# Altium schematic sheet SCB_CLKs.SchDoc: SCB_CLKs
size A3 portrait; PageSetup: Record=PageOptions|CenterHorizontal=True|CenterVertical=True|PrintScale=1.00|XCorrection=1.00|YCorrection=1.00|PrintKind=1|BorderSize=5000000|LeftOffset=0|BottomOffset=0|Orientation=1|PaperLength=1000|PaperWidth=1000|Scale=100|PaperSource=7|PrintQuality=-4|MediaType=1|DitherType=10|PaperKind=A4|PrintScaleMode=1; Revision: 3.4; SheetNumber: 3; SheetTotal: 23; Date: 18/06/2014; DrawnBy: J. Gabriel R.E.; Organization: Seven Solutions S.L.; Address1: C/Baza, Parcela 19, Nave 3; Address2: Polнgono Ind. Juncaril; Address3: 18210-Peligros-Granada; Address4: Spain; WebAddress: www.sevensols.com; Project: White Rabbit; ProjectName: White Rabbit
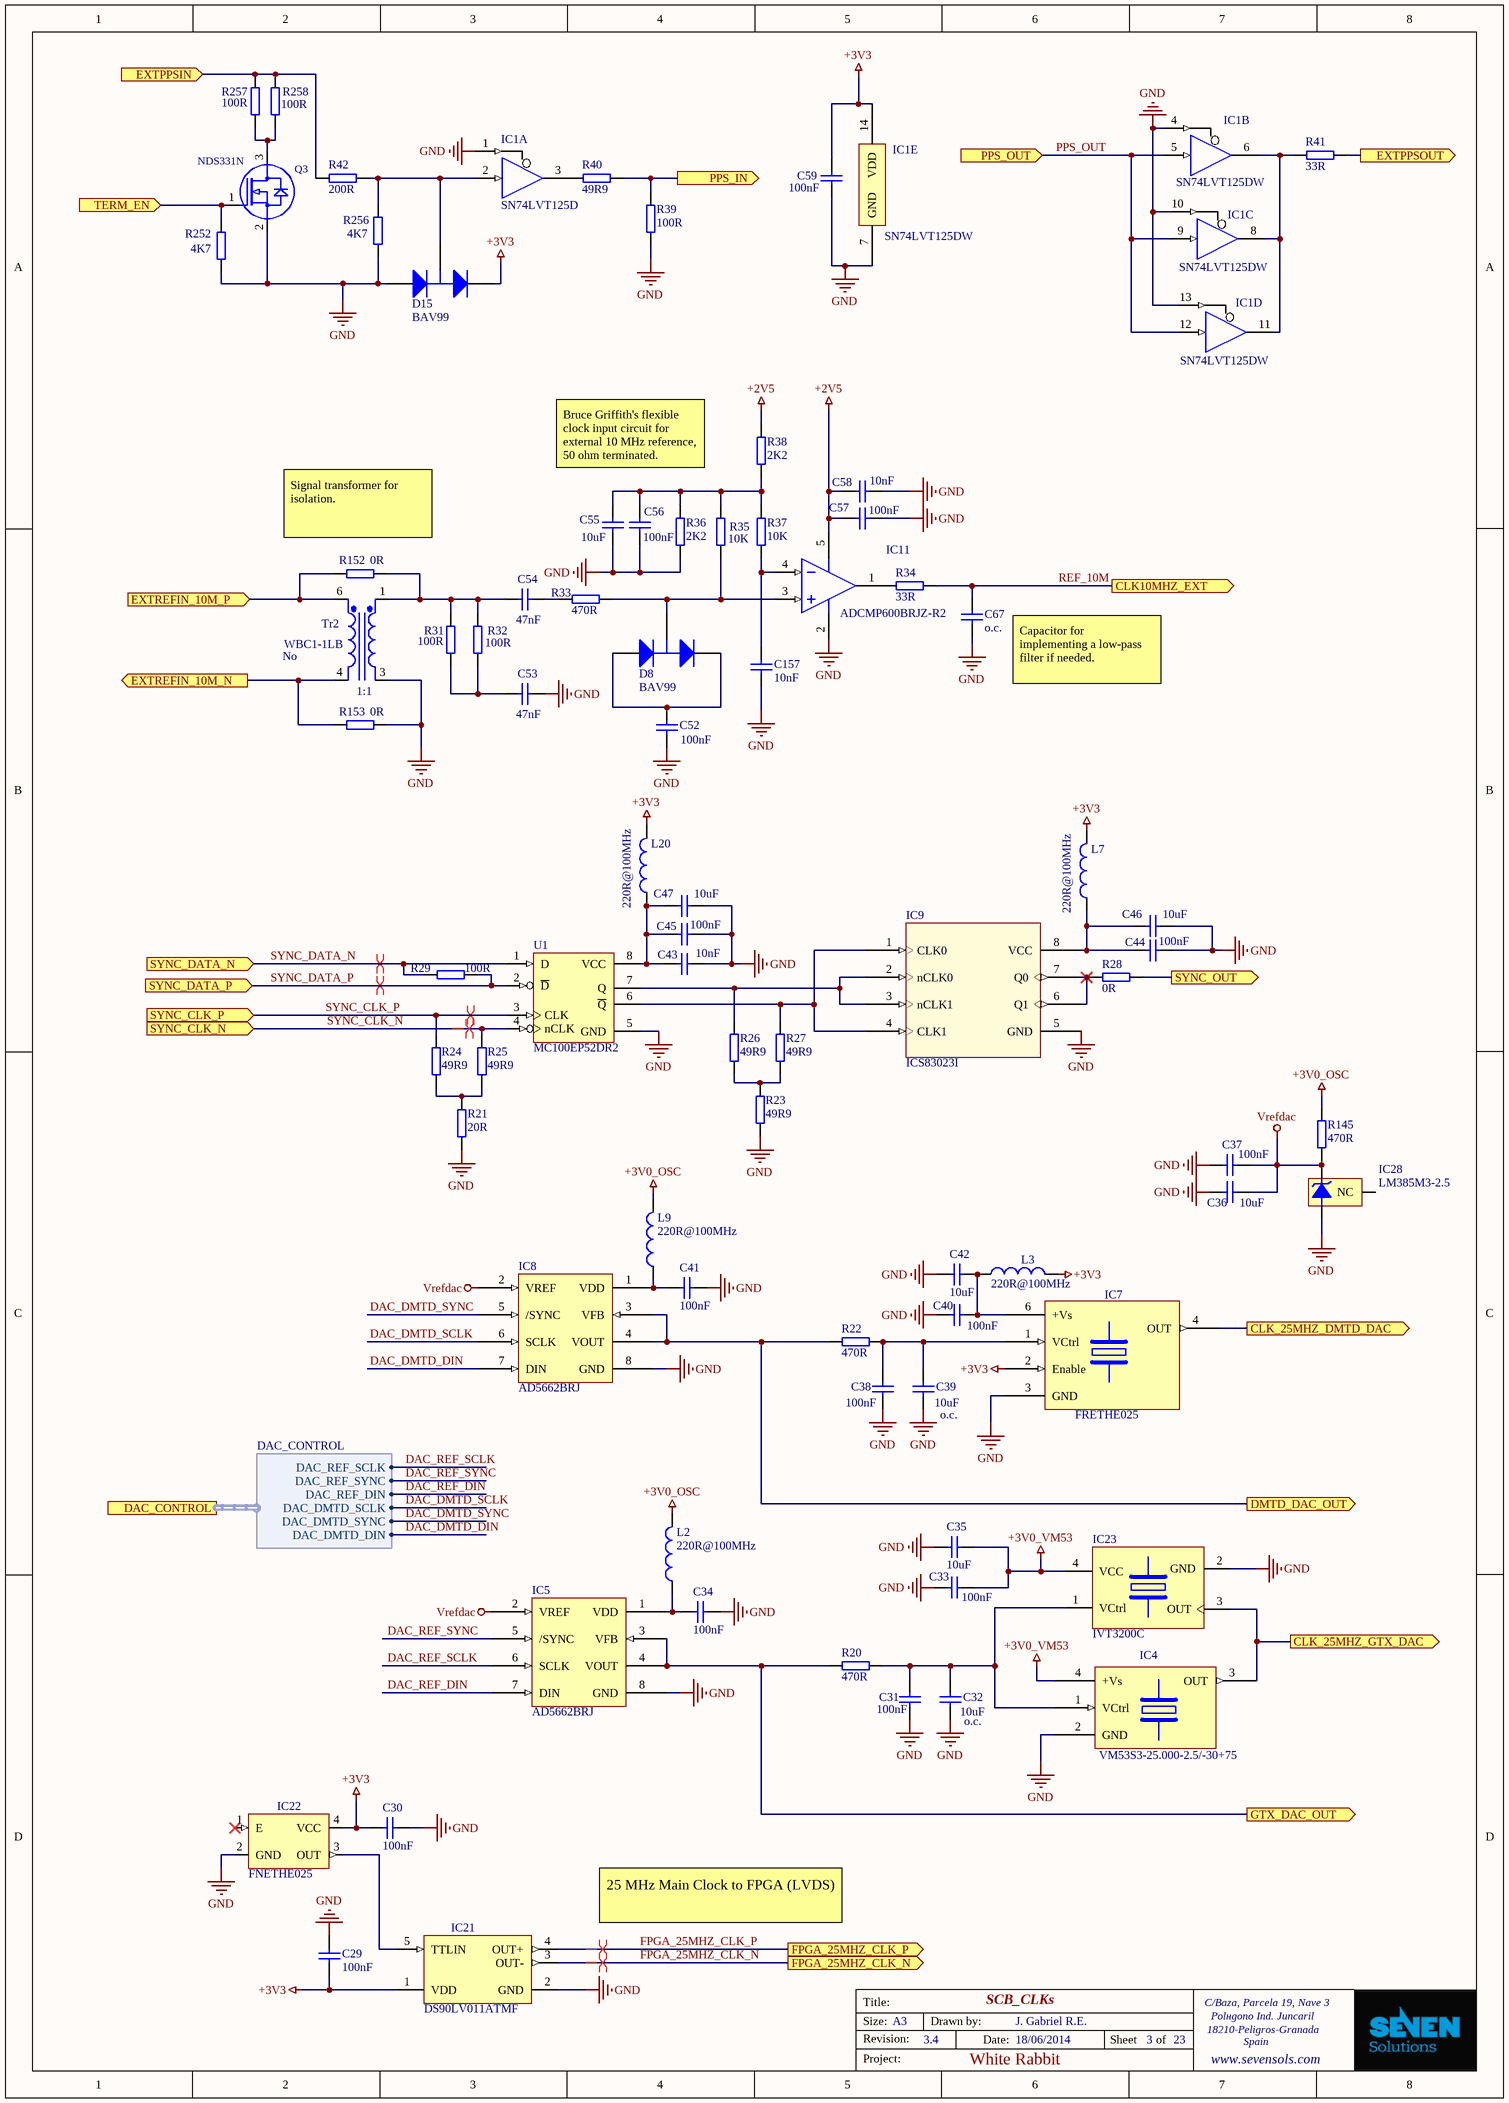
[diagram p0: SCB_CLKs.SchDoc]

## Parts
C29  100nF  [CC1005-0402]
C30  100nF  [CC1005-0402]
C31  100nF  [CC1005-0402]
C32  10uF  value o.c.  [CC1608-0603]
C33  100nF  [CC1005-0402]
C34  100nF  [CC1005-0402]
C35  10uF  [CC1608-0603]
C36  10uF  [CC1608-0603]
C37  100nF  [CC1005-0402]
C38  100nF  [CC1005-0402]
C39  10uF  value o.c.  [CC1608-0603]
C40  100nF  [CC1005-0402]
C41  100nF  [CC1005-0402]
C42  10uF  [CC1608-0603]
C43  10nF  [CC1005-0402]
C44  100nF  [CC1005-0402]
C45  100nF  [CC1005-0402]
C46  10uF  [CC1608-0603]
C47  10uF  [CC1608-0603]
C52  100nF  [CC1005-0402]
C53  47nF  [CC1005-0402]
C54  47nF  [CC1005-0402]
C55  10uF  [CC1608-0603]
C56  100nF  [CC1005-0402]
C57  100nF  [CC1005-0402]
C58  10nF  [CC1005-0402]
C59  100nF  [CC1005-0402]
C67  o.c.  [CC1608-0603]
C157  10nF  [CC1005-0402]
D8  BAV99  [SOT-23]
D15  BAV99  [SOT-23]
IC1  SN74LVT125D  [SO-14]  (parts A,B,C,D,E of 5)
IC4  VM53S3-25.000-2.5/-30+75  [VCTCXO_VM53S]
IC5  value AD5662BRJ  [SOT23-8]  (hidden comment: AD5662B)
IC7  FRETHE025  [vs-705]
IC8  value AD5662BRJ  [SOT23-8]  (hidden comment: AD5662B)
IC9  ICS83023I  [SOIC127P600X175-8N]
IC11  ADCMP600BRJZ-R2  [SOT23-5AL]
IC21  DS90LV011ATMF  [MF05A_N]
IC22  FNETHE025  [SPXO]
IC23  IVT3200C  [OSC_RAKON_IVT3200C]
IC28  LM385M3-2.5  [MF03A_N]
L2  Impedance: 220R@100MHz  [0603]  (hidden comment: 220R@100MHz Ferrite Bead)
L3  Impedance: 220R@100MHz  [0603]  (hidden comment: 220R@100MHz Ferrite Bead)
L7  Impedance: 220R@100MHz  [0603]  (hidden comment: 220R@100MHz Ferrite Bead)
L9  Impedance: 220R@100MHz  [0603]  (hidden comment: 220R@100MHz Ferrite Bead)
L20  Impedance: 220R@100MHz  [0603]  (hidden comment: 220R@100MHz Ferrite Bead)
Q3  NDS331N  [SOT23-3]
R20  470R  [0402]
R21  20R  [0603]
R22  470R  [0402]
R23  49R9  [0402]
R24  49R9  [0402]
R25  49R9  [0402]
R26  49R9  [0402]
R27  49R9  [0402]
R28  value 0R  [0402]  (hidden comment: Jumper)
R29  100R  [0402]
R31  100R  [0805]
R32  100R  [0805]
R33  470R  [0402]
R34  33R  [0603]
R35  10k  [0402]
R36  2K2  [0402]
R37  10k  [0402]
R38  2K2  [0402]
R39  100R  [0402]
R40  49R9  [0603]
R41  33R  [0603]
R42  200R  [0402]
R145  470R  [0402]
R152  value 0R  [0402]  (hidden comment: Jumper)
R153  value 0R  [0402]  (hidden comment: Jumper)
R252  4K7  [0402]
R256  4K7  [0402]
R257  100R  [0805]
R258  100R  [0805]
Tr2  WBC1-1LB  value 1:1  Mounted: No  [SMT6P150P]
U1  MC100EP52DR2  [TSOP65P490-8AN]

## Ports
CLK10MHZ_EXT (out), CLK_25MHZ_DMTD_DAC (out), CLK_25MHZ_GTX_DAC (out), DAC_CONTROL (harness DAC_CONTROL), DMTD_DAC_OUT (out), EXTPPSIN (in), EXTPPSOUT (out), EXTREFIN_10M_N (out), EXTREFIN_10M_P (in), FPGA_25MHZ_CLK_N (out), FPGA_25MHZ_CLK_P (out), GTX_DAC_OUT (out), PPS_IN (out), PPS_OUT (in), SYNC_CLK_N (in), SYNC_CLK_P (in), SYNC_DATA_N (in), SYNC_DATA_P (in), SYNC_OUT (out), TERM_EN (in)

## Harnesses
DAC_CONTROL: DAC_DMTD_DIN, DAC_DMTD_SYNC, DAC_DMTD_SCLK, DAC_REF_DIN, DAC_REF_SYNC, DAC_REF_SCLK

## Nets
+2V5: C57.2 C58.2 IC11.5(VCC/VCCO) R38.2
+3V0_OSC: L2.2 L9.2 R145.2
+3V0_VM53: C33.1 C35.1 IC4.4(+Vs) IC23.4(VCC)
+3V3: C29.2 C30.2 C59.2 D15.2(K) IC1.14(VDD) IC7.2(Enable) IC21.1(VDD) IC22.4(VCC) L3.2 L7.2 L20.2
GND: C29.1 C30.1 C31.1 C32.1 C33.2 C34.1 C35.2 C36.1 C37.2 C38.1 C39.1 C40.2 C41.1 C42.2 C43.2 C44.1 C45.1 C46.1 C47.1 C52.1 C53.2 C55.1 C56.1 C57.1 C58.1 C59.1 C67.1 C157.2 D15.1(A) IC1.1(~{A}) IC1.4(~{A}) IC1.7(GND) IC1.10(~{A}) IC1.13(~{A}) IC4.2(GND) IC5.8(GND) IC7.3(GND) IC8.8(GND) IC9.5(GND) IC11.2(VEE) IC21.2(GND) IC22.2(GND) IC23.2(GND) IC28.2(-V) Q3.2(SOURCE) R21.1 R23.2 R36.1 R39.1 R153.1 R252.2 R256.2 Tr2.3(Sec-) U1.5(GND)
Vrefdac: C36.2 C37.1 IC5.2(VREF) IC8.2(VREF) IC28.1(+V) R145.1
CLK_25MHZ_DMTD_DAC: IC7.4(OUT) ; port CLK_25MHZ_DMTD_DAC
CLK_25MHZ_GTX_DAC: IC4.3(OUT) IC23.3(OUT) ; port CLK_25MHZ_GTX_DAC
DAC_DMTD_DIN: IC8.7(DIN) ; port DAC_CONTROL.DAC_DMTD_DIN
DAC_DMTD_SCLK: IC8.6(SCLK) ; port DAC_CONTROL.DAC_DMTD_SCLK
DAC_DMTD_SYNC: IC8.5(/SYNC) ; port DAC_CONTROL.DAC_DMTD_SYNC
DAC_REF_DIN: IC5.7(DIN) ; port DAC_CONTROL.DAC_REF_DIN
DAC_REF_SCLK: IC5.6(SCLK) ; port DAC_CONTROL.DAC_REF_SCLK
DAC_REF_SYNC: IC5.5(/SYNC) ; port DAC_CONTROL.DAC_REF_SYNC
DMTD_DAC_OUT: IC8.3(VFB) IC8.4(VOUT) R22.1 ; port DMTD_DAC_OUT
EXTPPSIN: R42.2 R257.2 R258.2 ; port EXTPPSIN
EXTPPSOUT: R41.2 ; port EXTPPSOUT
EXTREFIN_10M_N: R153.2 Tr2.4(Pri-) ; port EXTREFIN_10M_N
EXTREFIN_10M_P: R152.2 Tr2.6(Pri+) ; port EXTREFIN_10M_P
FPGA_25MHZ_CLK_N: IC21.3(OUT-) ; port FPGA_25MHZ_CLK_N
FPGA_25MHZ_CLK_P: IC21.4(OUT+) ; port FPGA_25MHZ_CLK_P
GTX_DAC_OUT: IC5.3(VFB) IC5.4(VOUT) R20.1 ; port GTX_DAC_OUT
PPS_IN: R39.2 R40.2 ; port PPS_IN
PPS_OUT: IC1.5(B) IC1.9(B) IC1.12(B) ; port PPS_OUT
REF_10M: C67.2 R34.2 ; port CLK10MHZ_EXT
SYNC_CLK_N: R25.1 U1.4(nCLK) ; port SYNC_CLK_N
SYNC_CLK_P: R24.1 U1.3(CLK) ; port SYNC_CLK_P
SYNC_DATA_N: R29.1 U1.1(D) ; port SYNC_DATA_N
SYNC_DATA_P: R29.2 U1.2(~{D}) ; port SYNC_DATA_P
SYNC_OUT: R28.2 ; port SYNC_OUT
TERM_EN: Q3.1(GATE) R252.1 ; port TERM_EN
NetC31_2: C31.2 C32.2 IC4.1(VCtrl) IC23.1(VCtrl) R20.2
NetC34_2: C34.2 IC5.1(VDD) L2.1
NetC38_2: C38.2 C39.2 IC7.1(VCtrl) R22.2
NetC40_1: C40.1 C42.1 IC7.6(+Vs) L3.1
NetC41_2: C41.2 IC8.1(VDD) L9.1
NetC43_1: C43.1 C45.2 C47.2 L20.1 U1.8(VCC)
NetC44_2: C44.2 C46.2 IC9.8(VCC) L7.1
NetC52_2: C52.2 D8.1(A) D8.2(K)
NetC53_1: C53.1 R31.1 R32.1
NetC54_1: C54.1 R31.2 R32.2 R152.1 Tr2.1(Sec+)
NetC54_2: C54.2 R33.1
NetC55_2: C55.2 C56.2 R35.2 R36.2 R37.2 R38.1
NetC157_1: C157.1 IC11.4(VN) R37.1
NetD8_3: D8.3(C) IC11.3(VP) R33.2 R35.1
NetD15_3: D15.3(C) IC1.2(B) R42.1 R256.1
NetIC1_3: IC1.3(Y) R40.1
NetIC1_6: IC1.6(Y) IC1.8(Y) IC1.11(Y) R41.1
NetIC9_1: IC9.1(CLK0) IC9.4(CLK1) R27.1 U1.6(~{Q})
NetIC9_2: IC9.2(nCLK0) IC9.3(nCLK1) R26.1 U1.7(Q)
NetIC9_6: IC9.6(Q1) IC9.7(Q0) R28.1
NetIC11_1: IC11.1(Q) R34.1
NetIC21_5: IC21.5(TTLIN) IC22.3(OUT)
NetQ3_3: Q3.3(DRAIN) R257.1 R258.1
NetR21_2: R21.2 R24.2 R25.2
NetR23_1: R23.1 R26.2 R27.2

Not connected (* = marked no-connect by the designer): IC22 1(E)*; IC28 3(NC)

## Layout directives
differential pair: FPGA_25MHZ_CLK_N, FPGA_25MHZ_CLK_P, SYNC_CLK_N, SYNC_CLK_P, SYNC_DATA_N, SYNC_DATA_P

## Notes on the sheet
- Bruce Griffith's flexible clock input circuit for external 10 MHz reference, 50 ohm terminated.
- (near R152) Signal transformer for isolation.
- (near C67) Capacitor for implementing a low-pass filter if needed.
- 25 MHz Main Clock to FPGA (LVDS)
- Title:
- Size:
- Revision:
- A3
- Drawn by:
- Date:
- Sheet
- of
- Project:

## Library data of the parts
C29-C31 C33 C34 C37 C38 C40 C41 C44 C45 C52 C56 C57 C59 = CC0402_100NF_16V_10%_X7R: Capacitor; Manufacturer1: TDK; Manufacturer1 PN: C1005X7R1C104K; TC: X7R; Tolerance: ±10%; Voltage: 16V; Published: 8-Jun-2000; LatestRevisionDate: 17-Jul-2002; LatestRevisionNote: Re-released for DXP Platform.; PackageReference: RAD-0.3; Publisher: Altium Limited; Distributor1: Digikey; Distributor1 PN: 445-4952-1-ND; Case: 0402; Value: 100nF
C32 C39 = CC0603_10UF_6.3V_20%_X5R: Capacitor; Manufacturer1: TDK; Manufacturer1 PN: C1608X5R0J106M; TC: X5R; Tolerance: ±20%; Voltage: 6.3V; Mounted: No; Published: 8-Jun-2000; LatestRevisionDate: 17-Jul-2002; LatestRevisionNote: Re-released for DXP Platform.; PackageReference: RAD-0.3; Publisher: Altium Limited; Distributor1: Digikey; Distributor1 PN: 445-4112-1-ND; Case: 0603
C35 C36 C42 C46 C47 C55 = CC0603_10UF_6.3V_20%_X5R: Capacitor; Manufacturer1: TDK; Manufacturer1 PN: C1608X5R0J106M; TC: X5R; Tolerance: ±20%; Voltage: 6.3V; Published: 8-Jun-2000; LatestRevisionDate: 17-Jul-2002; LatestRevisionNote: Re-released for DXP Platform.; PackageReference: RAD-0.3; Publisher: Altium Limited; Distributor1: Digikey; Distributor1 PN: 445-4112-1-ND; Case: 0603; Value: 10uF
C43 C58 C157 = CC0402_10NF_25V_10%_X7R: Capacitor; Manufacturer1: TDK; Manufacturer1 PN: C1005X7R1E103K; TC: X7R; Tolerance: ±10%; Voltage: 25V; Published: 8-Jun-2000; LatestRevisionDate: 17-Jul-2002; LatestRevisionNote: Re-released for DXP Platform.; PackageReference: RAD-0.3; Publisher: Altium Limited; Distributor1: Digikey; Distributor1 PN: 445-1260-1-ND; Case: 0402; Value: 10nF
C53 C54 = CC0402_47NF_25V_10%_X7R: Capacitor; Manufacturer1: TDK; Manufacturer1 PN: C1005X7R1E473K; TC: X7R; Tolerance: ±10%; Voltage: 25V; Published: 8-Jun-2000; LatestRevisionDate: 17-Jul-2002; LatestRevisionNote: Re-released for DXP Platform.; PackageReference: RAD-0.3; Publisher: Altium Limited; Distributor1: Digikey; Distributor1 PN: 445-4941-1-ND; Case: 0402; Value: 47nF
C67 = CC0603_O.C.: Capacitor; Manufacturer1: Phycomp; TC: X7R; Tolerance: ±10%; Voltage: 16V; Mounted: No; Published: 8-Jun-2000; LatestRevisionDate: 17-Jul-2002; LatestRevisionNote: Re-released for DXP Platform.; PackageReference: RAD-0.3; Publisher: Altium Limited; Manufacturer1 PN: *; Distributor1: Digikey; Distributor1 PN: *; Case: 0402; Value: o.c.
D8 D15 = BAV99: Silicon Switching Diode Array for High-Speed Switching; RefId: 1081211; Published: 21-Mar-2003; DatasheetDocument: Oct-1999; PackageDocument: Sep-2001; PackageReference: SOT-23; Publisher: Altium Limited; ComponentLink1Description: Manufacturer Link; ComponentLink1URL: http://www.infineon.com/; ComponentLink2Description: Datasheet; ComponentLink2URL: http://www.infineon.com/upload/Document/cmc_upload/documents/080/631/bav99series_1.pdf; Supplier: Farnell; Value: BAV99
IC1 = SN74LVT125: Quad Buffer with 3-State Outputs with TTL Compatible Inputs; Value: SN74LVT125D; Distributor1 PN: 9592849; Distributor1: Farnell
IC4 = VCTCXO_VM53S: VCTCXO oscillator; Manufacturer1: MEC; Distributor1: RS; Distributor1 PN: 672-0797
IC5 IC8 = AD5662BRJ: Analog Devices 16-bit DAC w/SPI interface, ext ref; RefId: AD5662BRJZ-2REEL7DKR-ND; Supplier: Digikey
IC7 = VCXO_CFPV_45: VCXO oscillator; Manufacturer: Pericom; Distributor1: Digikey; Distributor1 PN: FRETHE025-ND; Manufacturer PN: FRETHE025
IC9 = ICS83023I: 350MHz Differential-to-LVCMOS Translator/Buffer; Manufacturer1 PN: ICS83023AMILF; Manufacturer1: IDT; Distributor1: Digikey; Distributor1 PN: 800-1102-5-ND
IC11 = ADCMP600: Analog Devices fast comparator; Distributor1: Digikey; Distributor1 PN: ADCMP600BRJZ-REEL7CT-ND; Manufacturer1 PN: ADCMP600BRJZ-R2; Manufacturer1: Analog Devices
IC21 = DS90LV011ATMF: Single High Speed Differential Driver; Manufacturer: National Semiconductor; CompType: Interface IC; PackageTopMarking: N01*XTT; PowerWise: N; Published: 4-Dec-2008; DatasheetVersion: May-2002; PackageVersion: revD, Aug-2008; PackageReference: MF05A; Publisher: Altium Limited; PackageDescription: Molded SOT-23, .115 x .063 x .040in Body, 5 Lead, .0375in Pitch; PartNumber: DS90LV011ATMF; RoHS: O; PinCount: 5; DigiKeyPartNumber: DS90LV011ATMFTR-ND; ComponentLink1Description: DS90LV011A Datasheet; ComponentLink1URL: http://www.national.com/ds/DS/DS90LV011A.pdf; ComponentLink2Description: DS90LV011A Web Page; ComponentLink2URL: http://www.national.com/pf/DS/DS90LV011A.html; ComponentLink3Description: MF05A Package Page; ComponentLink3URL: http://www.national.com/packaging/folders/mf05a.html
IC22 = OSC_CFPS-73: SMD oscillator 3.3V (Elfa); Value: FNETHE025; Distributor: Digikey; Distributor PN: FNETHE025CT-ND
IC23 = IVT32000C
IC28 = LM385M3-2.5: Micropower Voltage Reference Diode; Manufacturer: National Semiconductor; CompType: Voltage Reference IC; PackageTopMarking: R12*XTT; Published: 4-Dec-2008; DatasheetVersion: Jan-2008; PackageVersion: revB, Mar-2003; PackageReference: MF03A; Publisher: Altium Limited; PackageDescription: Molded SOT-23, .115 x .051 x .037in Body, 3 Lead, .075 in Pitch; PartNumber: LM385M3-2.5; RoHS: O; PinCount: 3; DigiKeyPartNumber: LM385M3-2.5CT-ND; ComponentLink1Description: LM385-2.5 Datasheet; ComponentLink1URL: http://www.national.com/ds/LM/LM385-2.5.pdf; ComponentLink2Description: LM385-2.5 Web Page; ComponentLink2URL: http://www.national.com/pf/LM/LM385-2.5.html; ComponentLink3Description: MF03A Package Page; ComponentLink3URL: http://www.national.com/packaging/folders/mf03a.html
L2 L3 L7 L9 L20 = L_FERRITE_BEAD: ferrite bead; Manufacturer1: Murata; Manufacturer1 PN: BLM18KG221SN1D; Current Rating: 2.2A; DCR: 50mOhm; Case: 0603; Distributor1: Digikey; Distributor1 PN: 490-5255-1-ND
Q3 = NDS331N: N-Channel Logic Level Enhancement Mode Field Effect Transistor; DEVICE: NDS331N; VALUE: NDS331N; Distributor1 PN: NDS331NCT-ND; Distributor1: Digikey
R20 R22 R33 R145 = R0402_470R_±1%_0.1W_100PPM: SMD Resistor; Manufacturer1: Panasonic; Manufacturer1 PN: ERJ-2RKF4700X; TCR: 100ppm; Power Rating: 0.1W; Tolerance: ±1%; Case: 0402; Distributor1: DigiKey; Distributor1 PN: P470LCT-ND; Value: 470R
R21 = R0603_20R_±1%_0.25W_100PPM: SMD Resistor; Manufacturer1: Vishay; Manufacturer1 PN: CRCW060320R0FKEAHP; TCR: 100ppm; Power Rating: 0.25W; Tolerance: ±1%; Case: 0603; Distributor1: DigiKey; Distributor1 PN: 541-20.0SCT-ND; Value: 20R
R23-R27 = R0402_49R9_±1%_0.1W_100PPM: SMD Resistor; Manufacturer1: Panasonic; Manufacturer1 PN: ERJ-2RKF49R9X; TCR: 100ppm; Power Rating: 0.1W; Tolerance: ±1%; Case: 0402; Distributor1: DigiKey; Distributor1 PN: P49.9LCT-ND; Value: 49R9
R28 R152 R153 = R0402_0R_0.1W_JUMPER: SMD Resistor; Manufacturer1: Panasonic; Manufacturer1 PN: ERJ-2GE0R00X; TCR: 100ppm; Power Rating: 0.1W; Case: 0402; Distributor1: DigiKey; Distributor1 PN: P0.0JCT-ND; Tolerance: Jumper
R29 R39 = R0402_100R_±1%_0.1W_100PPM: SMD Resistor; Manufacturer1: Panasonic; Manufacturer1 PN: ERJ-2RKF1000X; TCR: 100ppm; Power Rating: 0.1W; Tolerance: ±1%; Case: 0402; Distributor1: DigiKey; Distributor1 PN: P100LCT-ND; Value: 100R
R31 R32 R257 R258 = R0805_100R_±1%_0.33W_100PPM: SMD Resistor; Manufacturer1: Vishay Dale; Manufacturer1 PN: CRCW0805100RFKEAHP; TCR: 100ppm; Power Rating: 0.33W; Tolerance: ±1%; Case: 0805; Distributor1: DigiKey; Distributor1 PN: 541-100TCT-ND; Value: 100R
R34 R41 = R0603_33R_±1%_0.25W_100PPM: SMD Resistor; Manufacturer1: Vishay/Dale; Manufacturer1 PN: CRCW060333R0FKEAHP; TCR: 100ppm; Power Rating: 0.25W; Tolerance: ±1%; Distributor1: DigiKey; Distributor1 PN: 541-33.0SCT-ND; Value: 33R
  R34: Case: 0603
  R41: Case: 0402
R35 R37 = R0402_10K_±1%_0.1W_100PPM: SMD Resistor; Manufacturer1: Panasonic; Manufacturer1 PN: ERJ-2RKF1002X; TCR: 100ppm; Power Rating: 0.1W; Tolerance: ±1%; Case: 0402; Distributor1: DigiKey; Distributor1 PN: P10.0KLCT-ND; Value: 10K
R36 R38 = R0402_2K2_±1%_0.1W_100PPM: SMD Resistor; Manufacturer1: Panasonic; Manufacturer1 PN: ERJ-2RKF2201X; TCR: 100ppm; Power Rating: 0.1W; Tolerance: ±1%; Case: 0402; Distributor1: DigiKey; Distributor1 PN: P2.20KLCT-ND; Value: 2K2
R40 = R0603_49R9_±1%_0.25W_100PPM: SMD Resistor; Manufacturer1: Vishay/Dale; Manufacturer1 PN: CRCW060349R9FKEAHP; TCR: 100ppm; Power Rating: 0.25W; Tolerance: ±1%; Case: 0603; Distributor1: DigiKey; Distributor1 PN: 541-49.9SCT-ND; Value: 49R9
R42 = R0402_200R_±1%_0.1W_100PPM: SMD Resistor; Manufacturer1: Panasonic; Manufacturer1 PN: ERJ-2RKF2000X; TCR: 100ppm; Power Rating: 0.1W; Tolerance: ±1%; Case: 0402; Distributor1: DigiKey; Distributor1 PN: P200LCT-ND; Value: 200R
R252 R256 = R0402_4.7K_±1%_0.1W_100PPM: SMD Resistor; Manufacturer1: Panasonic; Manufacturer1 PN: ERJ-2RKF4701X; TCR: 100ppm; Power Rating: 0.1W; Tolerance: ±1%; Case: 0402; Distributor1: DigiKey; Distributor1 PN: ERJ-2RKF4701X; Value: 4K7
Tr2 = WBC1-1LB: SMT Mini WideBand Transformer 1:1, 10uH,; Manufacturer: Coilcraft; Published: 8-Jun-2000; LatestRevisionDate: 17-Jul-2002; LatestRevisionNote: Re-released for DXP Platform.; PackageReference: TRF_4; Publisher: Altium Limited; Manufacturer PN: WBC1-1LB
U1 = MC100EP52DR2: Differential Data and Clock D-Type Flip-Flop; Manufacturer1: On Semiconductors; Manufacturer1 PN: MC100EP52DTG; Distributor1: Digikey; Distributor1 PN: MC100EP52DTGOS-ND